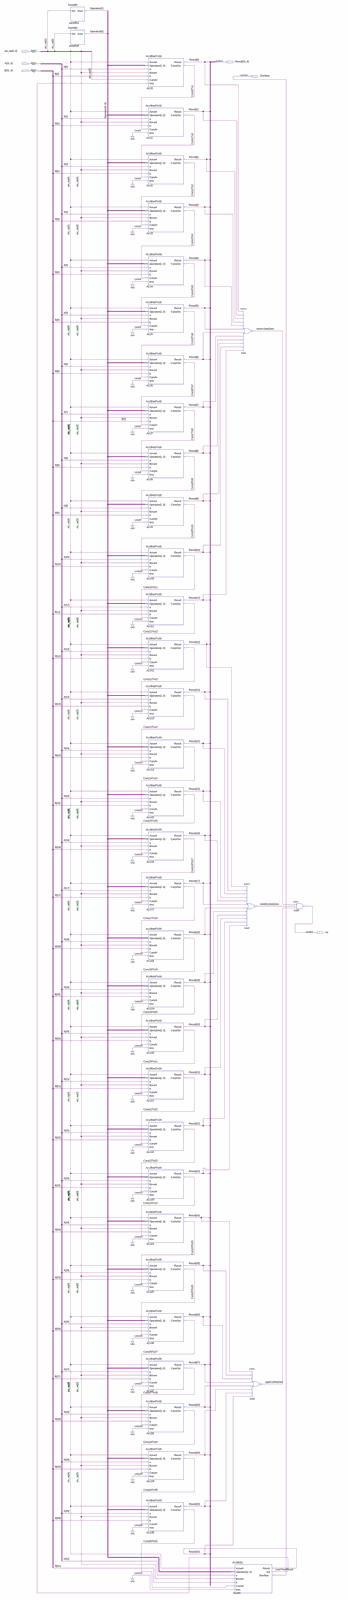
[diagram p0: schematic sheet, whole]
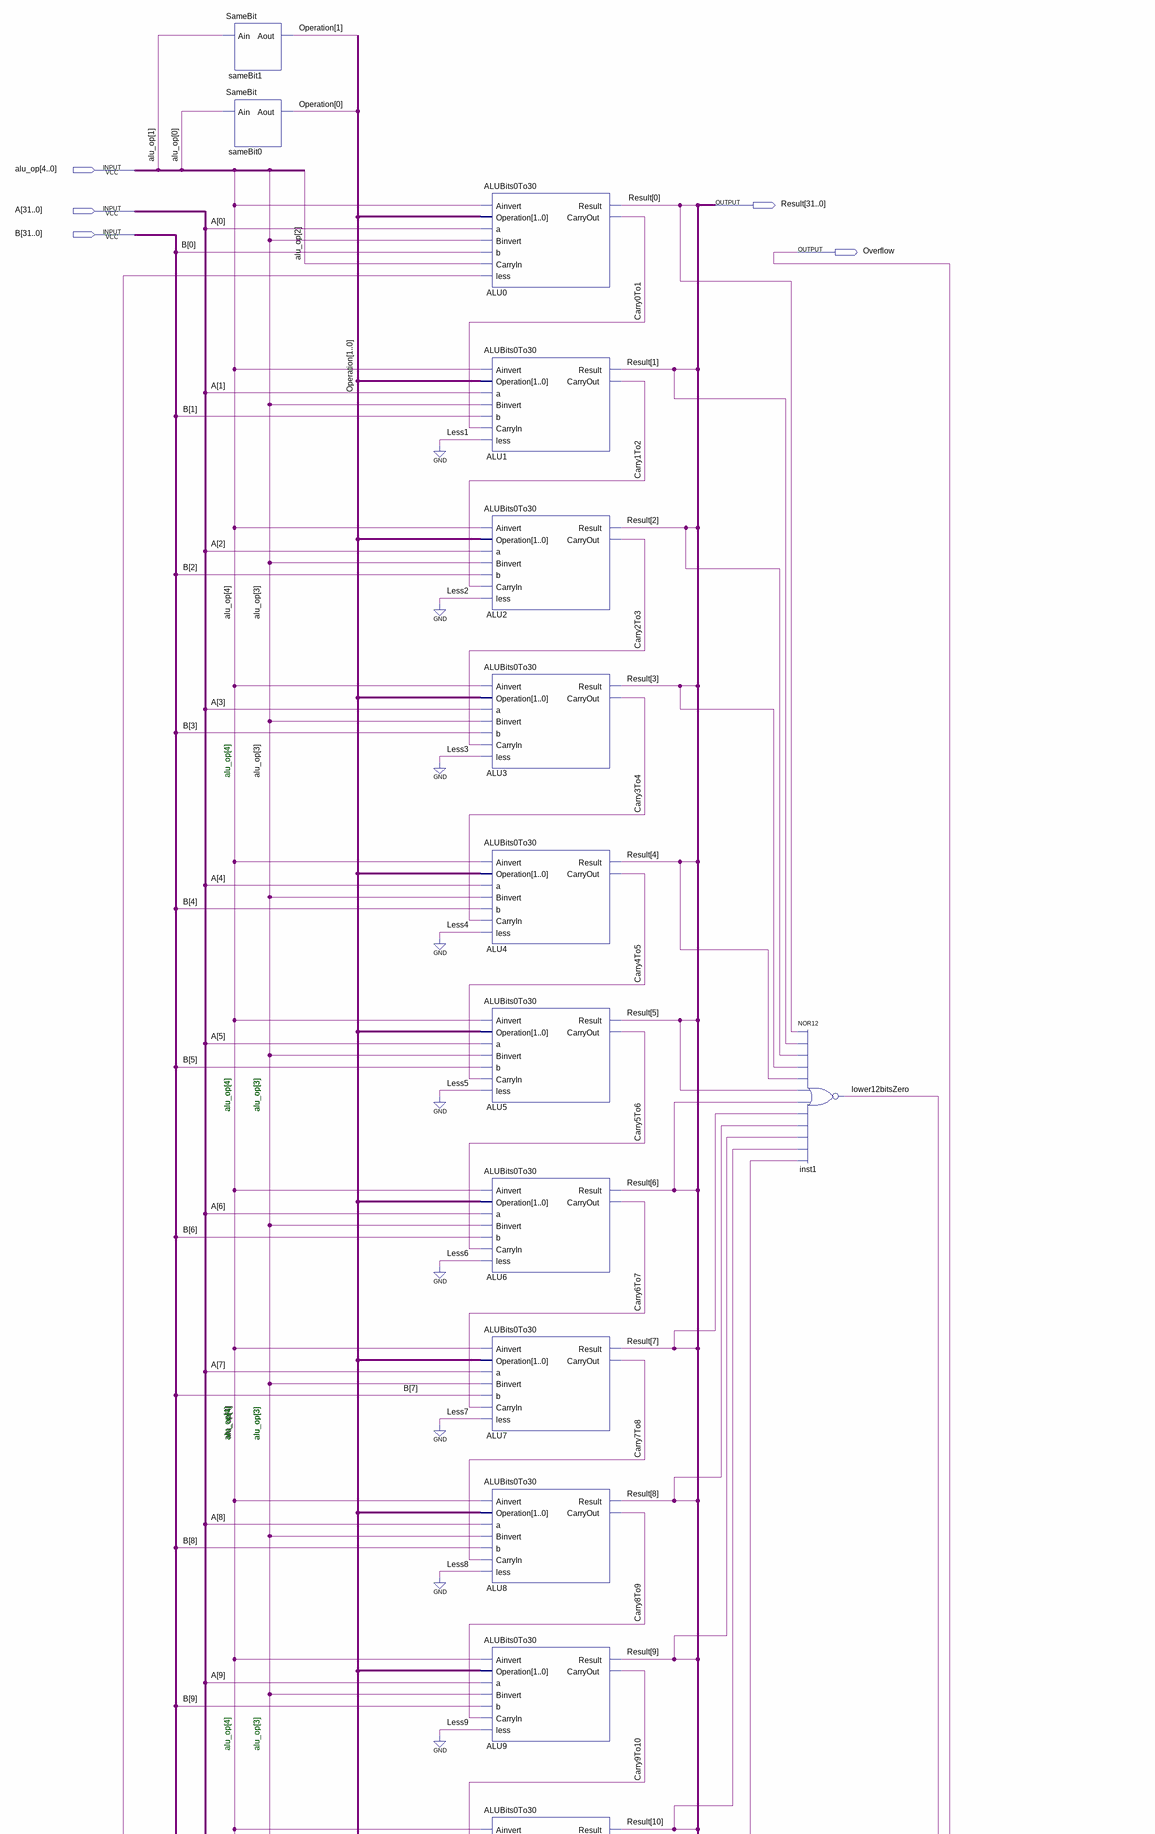
[diagram p1: schematic sheet, upper part]
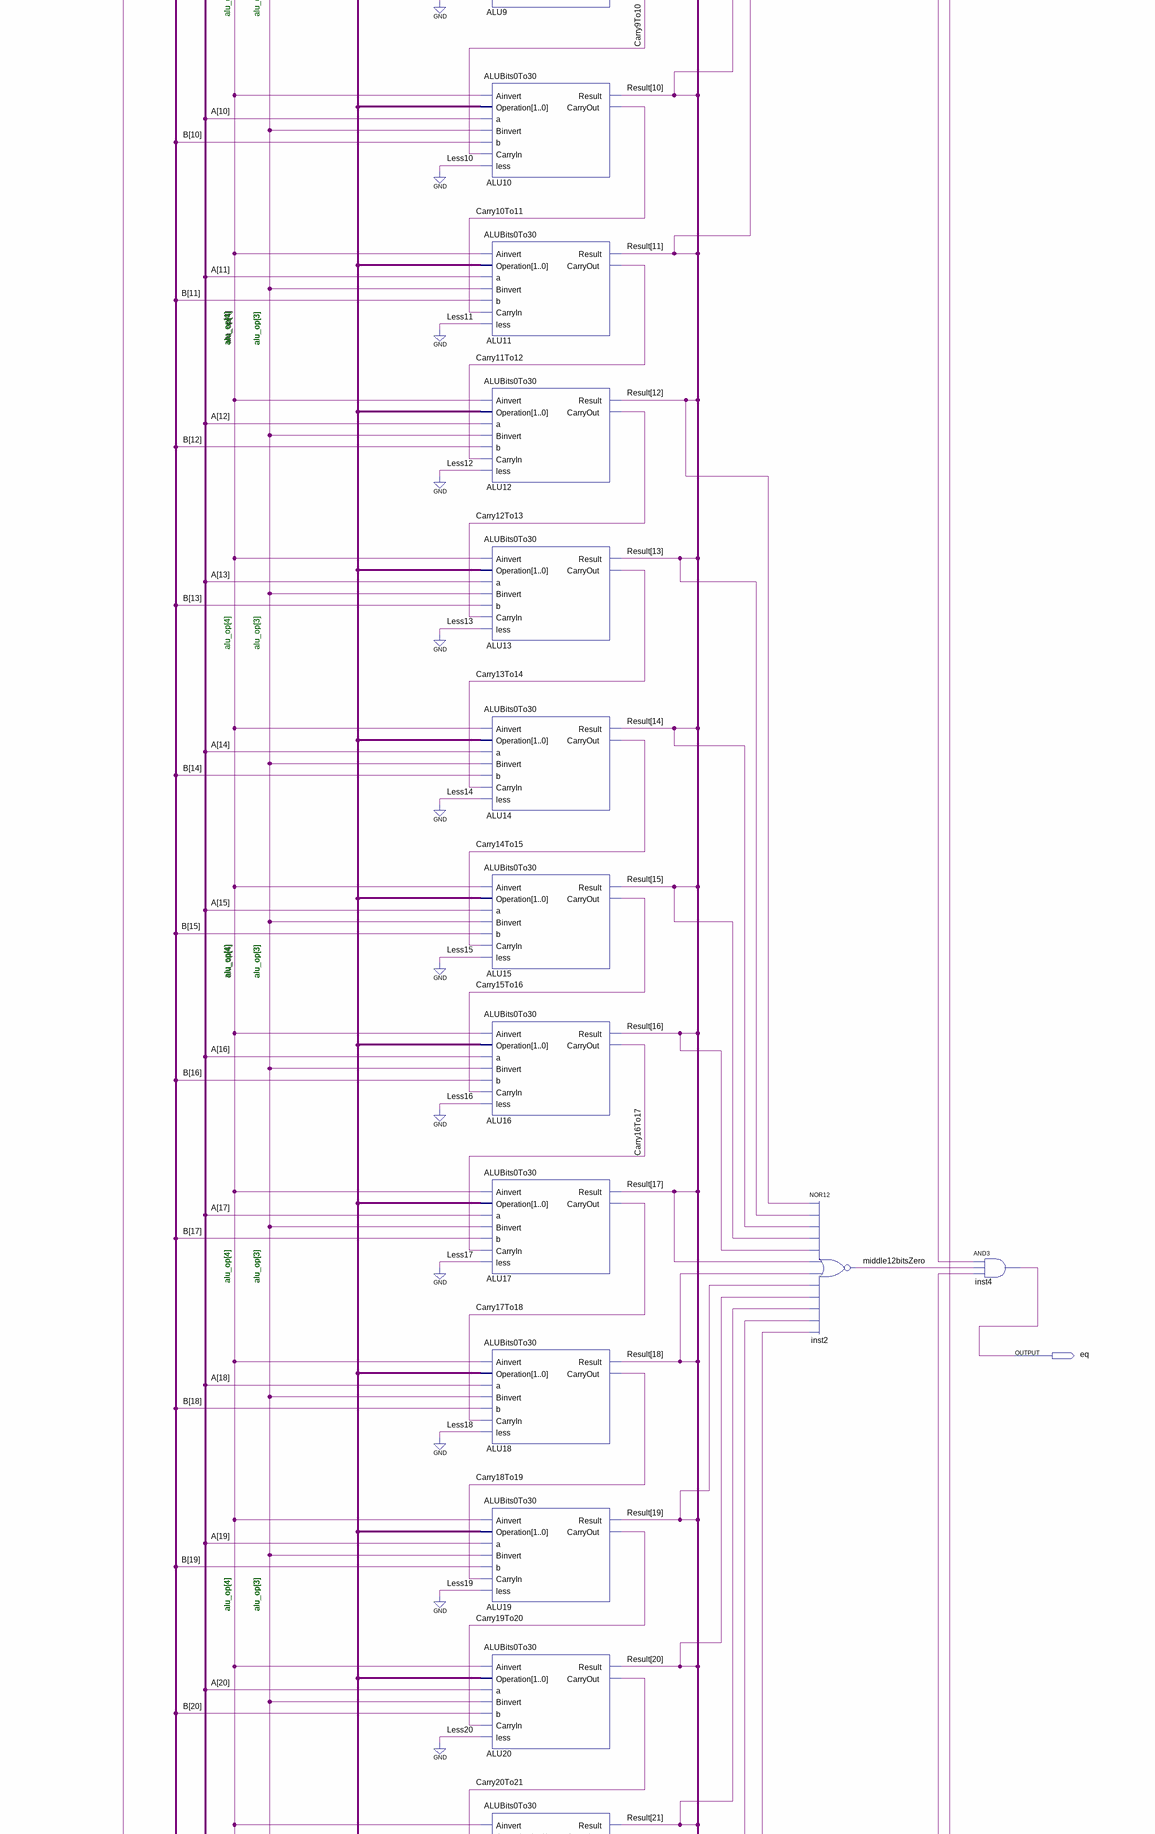
[diagram p2: schematic sheet, middle part]
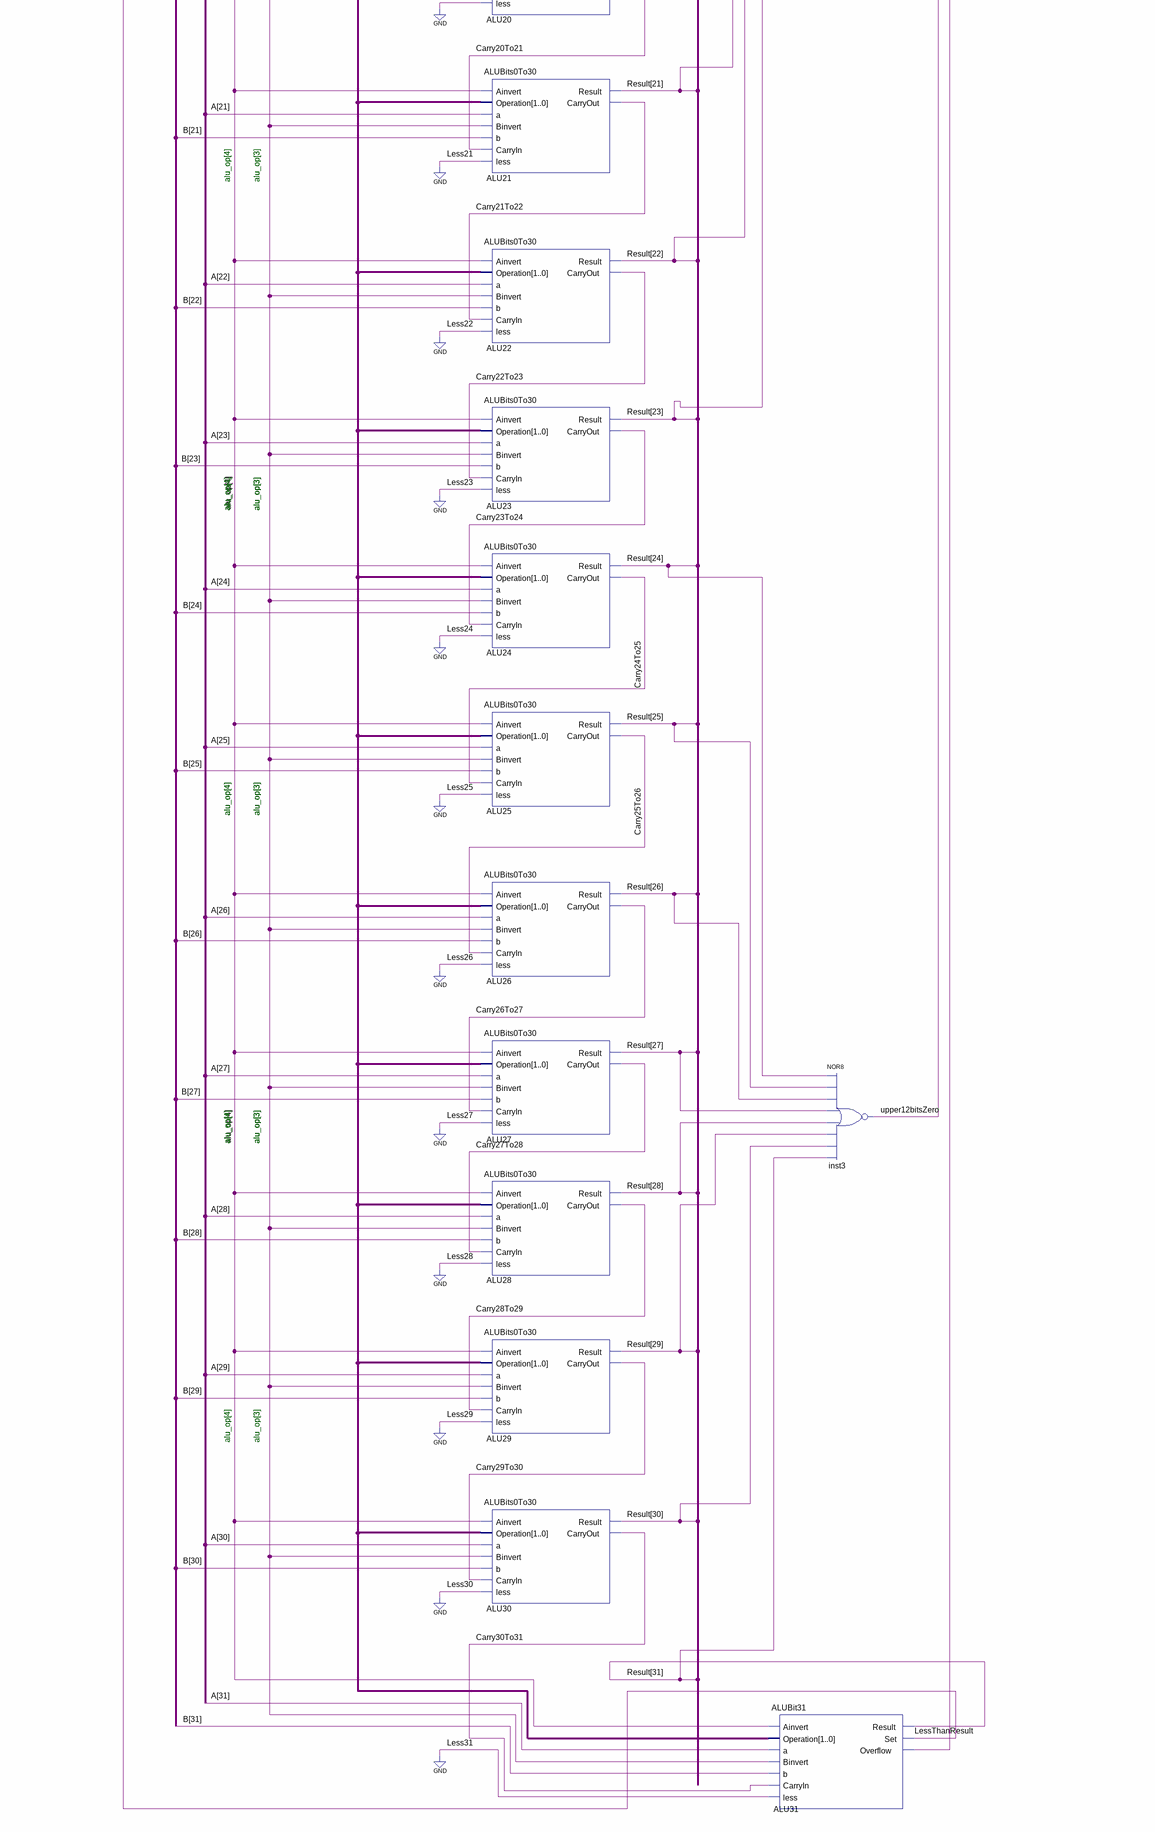
[diagram p3: schematic sheet, lower part]
// Quartus schematic ALU32.bdf as structural Verilog: 38 symbols, 6 pins
module ALU32 (
  input  [4:0] alu_op,
  input  [31:0] A,
  input  [31:0] B,
  output [31:0] Result,
  output Overflow,
  output eq
);

  wire Carry0To1, Carry1To2, Carry2To3, Carry3To4, Carry4To5, Carry5To6, Carry6To7, Carry7To8, Carry8To9,
       Carry9To10, Carry10To11, Carry11To12, Carry12To13, Carry13To14, Carry14To15, Carry15To16, Carry16To17,
       Carry17To18, Carry18To19, Carry19To20, Carry20To21, Carry21To22, Carry22To23, Carry23To24,
       Carry24To25, Carry25To26, Carry26To27, Carry27To28, Carry28To29, Carry29To30, Carry30To31,
       LessThanResult, lower12bitsZero, middle12bitsZero, upper12bitsZero;
  wire [1:0] Operation;

  SameBit sameBit1 (.Ain(alu_op[1]), .Aout(Operation[1]));
  SameBit sameBit0 (.Ain(alu_op[0]), .Aout(Operation[0]));
  ALUBits0To30 ALU0 (
    .Ainvert(alu_op[4]), .Operation(Operation), .a(A[0]), .Binvert(alu_op[3]), .b(B[0]), .CarryIn(alu_op[2]),
    .less(LessThanResult), .Result(Result[0]), .CarryOut(Carry0To1));
  ALUBits0To30 ALU1 (
    .Ainvert(alu_op[4]), .Operation(Operation), .a(A[1]), .Binvert(alu_op[3]), .b(B[1]), .CarryIn(Carry0To1),
    .less(1'b0), .Result(Result[1]), .CarryOut(Carry1To2));
  ALUBits0To30 ALU2 (
    .Ainvert(alu_op[4]), .Operation(Operation), .a(A[2]), .Binvert(alu_op[3]), .b(B[2]), .CarryIn(Carry1To2),
    .less(1'b0), .Result(Result[2]), .CarryOut(Carry2To3));
  ALUBits0To30 ALU3 (
    .Ainvert(alu_op[4]), .Operation(Operation), .a(A[3]), .Binvert(alu_op[3]), .b(B[3]), .CarryIn(Carry2To3),
    .less(1'b0), .Result(Result[3]), .CarryOut(Carry3To4));
  ALUBits0To30 ALU4 (
    .Ainvert(alu_op[4]), .Operation(Operation), .a(A[4]), .Binvert(alu_op[3]), .b(B[4]), .CarryIn(Carry3To4),
    .less(1'b0), .Result(Result[4]), .CarryOut(Carry4To5));
  ALUBits0To30 ALU5 (
    .Ainvert(alu_op[4]), .Operation(Operation), .a(A[5]), .Binvert(alu_op[3]), .b(B[5]), .CarryIn(Carry4To5),
    .less(1'b0), .Result(Result[5]), .CarryOut(Carry5To6));
  ALUBits0To30 ALU6 (
    .Ainvert(alu_op[4]), .Operation(Operation), .a(A[6]), .Binvert(alu_op[3]), .b(B[6]), .CarryIn(Carry5To6),
    .less(1'b0), .Result(Result[6]), .CarryOut(Carry6To7));
  ALUBits0To30 ALU7 (
    .Ainvert(alu_op[4]), .Operation(Operation), .a(A[7]), .Binvert(alu_op[3]), .b(B[7]), .CarryIn(Carry6To7),
    .less(1'b0), .Result(Result[7]), .CarryOut(Carry7To8));
  ALUBits0To30 ALU8 (
    .Ainvert(alu_op[4]), .Operation(Operation), .a(A[8]), .Binvert(alu_op[3]), .b(B[8]), .CarryIn(Carry7To8),
    .less(1'b0), .Result(Result[8]), .CarryOut(Carry8To9));
  ALUBits0To30 ALU9 (
    .Ainvert(alu_op[4]), .Operation(Operation), .a(A[9]), .Binvert(alu_op[3]), .b(B[9]), .CarryIn(Carry8To9),
    .less(1'b0), .Result(Result[9]), .CarryOut(Carry9To10));
  ALUBits0To30 ALU10 (
    .Ainvert(alu_op[4]), .Operation(Operation), .a(A[10]), .Binvert(alu_op[3]), .b(B[10]),
    .CarryIn(Carry9To10), .less(1'b0), .Result(Result[10]), .CarryOut(Carry10To11));
  ALUBits0To30 ALU11 (
    .Ainvert(alu_op[4]), .Operation(Operation), .a(A[11]), .Binvert(alu_op[3]), .b(B[11]),
    .CarryIn(Carry10To11), .less(1'b0), .Result(Result[11]), .CarryOut(Carry11To12));
  ALUBits0To30 ALU12 (
    .Ainvert(alu_op[4]), .Operation(Operation), .a(A[12]), .Binvert(alu_op[3]), .b(B[12]),
    .CarryIn(Carry11To12), .less(1'b0), .Result(Result[12]), .CarryOut(Carry12To13));
  ALUBits0To30 ALU13 (
    .Ainvert(alu_op[4]), .Operation(Operation), .a(A[13]), .Binvert(alu_op[3]), .b(B[13]),
    .CarryIn(Carry12To13), .less(1'b0), .Result(Result[13]), .CarryOut(Carry13To14));
  ALUBits0To30 ALU14 (
    .Ainvert(alu_op[4]), .Operation(Operation), .a(A[14]), .Binvert(alu_op[3]), .b(B[14]),
    .CarryIn(Carry13To14), .less(1'b0), .Result(Result[14]), .CarryOut(Carry14To15));
  ALUBits0To30 ALU15 (
    .Ainvert(alu_op[4]), .Operation(Operation), .a(A[15]), .Binvert(alu_op[3]), .b(B[15]),
    .CarryIn(Carry14To15), .less(1'b0), .Result(Result[15]), .CarryOut(Carry15To16));
  ALUBits0To30 ALU16 (
    .Ainvert(alu_op[4]), .Operation(Operation), .a(A[16]), .Binvert(alu_op[3]), .b(B[16]),
    .CarryIn(Carry15To16), .less(1'b0), .Result(Result[16]), .CarryOut(Carry16To17));
  ALUBits0To30 ALU17 (
    .Ainvert(alu_op[4]), .Operation(Operation), .a(A[17]), .Binvert(alu_op[3]), .b(B[17]),
    .CarryIn(Carry16To17), .less(1'b0), .Result(Result[17]), .CarryOut(Carry17To18));
  ALUBits0To30 ALU18 (
    .Ainvert(alu_op[4]), .Operation(Operation), .a(A[18]), .Binvert(alu_op[3]), .b(B[18]),
    .CarryIn(Carry17To18), .less(1'b0), .Result(Result[18]), .CarryOut(Carry18To19));
  ALUBits0To30 ALU19 (
    .Ainvert(alu_op[4]), .Operation(Operation), .a(A[19]), .Binvert(alu_op[3]), .b(B[19]),
    .CarryIn(Carry18To19), .less(1'b0), .Result(Result[19]), .CarryOut(Carry19To20));
  ALUBits0To30 ALU20 (
    .Ainvert(alu_op[4]), .Operation(Operation), .a(A[20]), .Binvert(alu_op[3]), .b(B[20]),
    .CarryIn(Carry19To20), .less(1'b0), .Result(Result[20]), .CarryOut(Carry20To21));
  ALUBits0To30 ALU21 (
    .Ainvert(alu_op[4]), .Operation(Operation), .a(A[21]), .Binvert(alu_op[3]), .b(B[21]),
    .CarryIn(Carry20To21), .less(1'b0), .Result(Result[21]), .CarryOut(Carry21To22));
  ALUBits0To30 ALU22 (
    .Ainvert(alu_op[4]), .Operation(Operation), .a(A[22]), .Binvert(alu_op[3]), .b(B[22]),
    .CarryIn(Carry21To22), .less(1'b0), .Result(Result[22]), .CarryOut(Carry22To23));
  ALUBits0To30 ALU23 (
    .Ainvert(alu_op[4]), .Operation(Operation), .a(A[23]), .Binvert(alu_op[3]), .b(B[23]),
    .CarryIn(Carry22To23), .less(1'b0), .Result(Result[23]), .CarryOut(Carry23To24));
  ALUBits0To30 ALU24 (
    .Ainvert(alu_op[4]), .Operation(Operation), .a(A[24]), .Binvert(alu_op[3]), .b(B[24]),
    .CarryIn(Carry23To24), .less(1'b0), .Result(Result[24]), .CarryOut(Carry24To25));
  ALUBits0To30 ALU25 (
    .Ainvert(alu_op[4]), .Operation(Operation), .a(A[25]), .Binvert(alu_op[3]), .b(B[25]),
    .CarryIn(Carry24To25), .less(1'b0), .Result(Result[25]), .CarryOut(Carry25To26));
  ALUBits0To30 ALU26 (
    .Ainvert(alu_op[4]), .Operation(Operation), .a(A[26]), .Binvert(alu_op[3]), .b(B[26]),
    .CarryIn(Carry25To26), .less(1'b0), .Result(Result[26]), .CarryOut(Carry26To27));
  ALUBits0To30 ALU27 (
    .Ainvert(alu_op[4]), .Operation(Operation), .a(A[27]), .Binvert(alu_op[3]), .b(B[27]),
    .CarryIn(Carry26To27), .less(1'b0), .Result(Result[27]), .CarryOut(Carry27To28));
  ALUBits0To30 ALU28 (
    .Ainvert(alu_op[4]), .Operation(Operation), .a(A[28]), .Binvert(alu_op[3]), .b(B[28]),
    .CarryIn(Carry27To28), .less(1'b0), .Result(Result[28]), .CarryOut(Carry28To29));
  ALUBits0To30 ALU29 (
    .Ainvert(alu_op[4]), .Operation(Operation), .a(A[29]), .Binvert(alu_op[3]), .b(B[29]),
    .CarryIn(Carry28To29), .less(1'b0), .Result(Result[29]), .CarryOut(Carry29To30));
  ALUBits0To30 ALU30 (
    .Ainvert(alu_op[4]), .Operation(Operation), .a(A[30]), .Binvert(alu_op[3]), .b(B[30]),
    .CarryIn(Carry29To30), .less(1'b0), .Result(Result[30]), .CarryOut(Carry30To31));
  ALUBit31 ALU31 (
    .Ainvert(alu_op[4]), .Operation(Operation), .a(A[31]), .Binvert(alu_op[3]), .b(B[31]),
    .CarryIn(Carry30To31), .less(1'b0), .Result(Result[31]), .Set(LessThanResult), .Overflow(Overflow));
  nor inst1 (lower12bitsZero, Result[0], Result[1], Result[2], Result[3], Result[4], Result[5], Result[6], Result[7], Result[8], Result[9], Result[10], Result[11]);
  nor inst2 (middle12bitsZero, Result[12], Result[13], Result[14], Result[15], Result[16], Result[17], Result[18], Result[19], Result[20], Result[21], Result[22], Result[23]);
  nor inst3 (upper12bitsZero, Result[24], Result[25], Result[26], Result[27], Result[28], Result[29], Result[30], Result[31]);
  and inst4 (eq, lower12bitsZero, middle12bitsZero, upper12bitsZero);

  // Notes on the sheet:
  //   alu_op[4]
  //   alu_op[4]
  //   alu_op[4]
  //   alu_op[3]
  //   alu_op[3]
  //   alu_op[4]
  //   alu_op[4]
  //   alu_op[3]
  //   alu_op[3]
  //   alu_op[4]
  //   alu_op[4]
  //   alu_op[3]
  //   alu_op[3]
  //   alu_op[4]
  //   alu_op[4]
  //   alu_op[4]
  //   alu_op[3]
  //   alu_op[3]
  //   alu_op[3]
  //   alu_op[4]
  //   alu_op[4]
  //   alu_op[3]
  //   alu_op[3]
  //   alu_op[4]
  //   alu_op[4]
  //   alu_op[4]
  //   alu_op[3]
  //   alu_op[3]
  //   alu_op[3]
  //   alu_op[4]
  //   alu_op[4]
  //   alu_op[3]
  //   alu_op[3]
  //   alu_op[4]
  //   alu_op[4]
  //   alu_op[4]
  //   alu_op[3]
  //   alu_op[3]
  //   alu_op[3]
  //   alu_op[4]
  //   alu_op[4]
  //   alu_op[3]
  //   alu_op[3]
  //   alu_op[4]
  //   alu_op[4]
  //   alu_op[4]
  //   alu_op[3]
  //   alu_op[3]
  //   alu_op[3]
  //   alu_op[4]
  //   alu_op[4]
  //   alu_op[3]
  //   alu_op[3]
  //   alu_op[4]
  //   alu_op[4]
  //   alu_op[4]
  //   alu_op[3]
  //   alu_op[3]
  //   alu_op[3]
  //   alu_op[4]
  //   alu_op[4]
  //   alu_op[3]
  //   alu_op[3]
endmodule
